# Altium schematic sheet Precharge.SchDoc
size A3
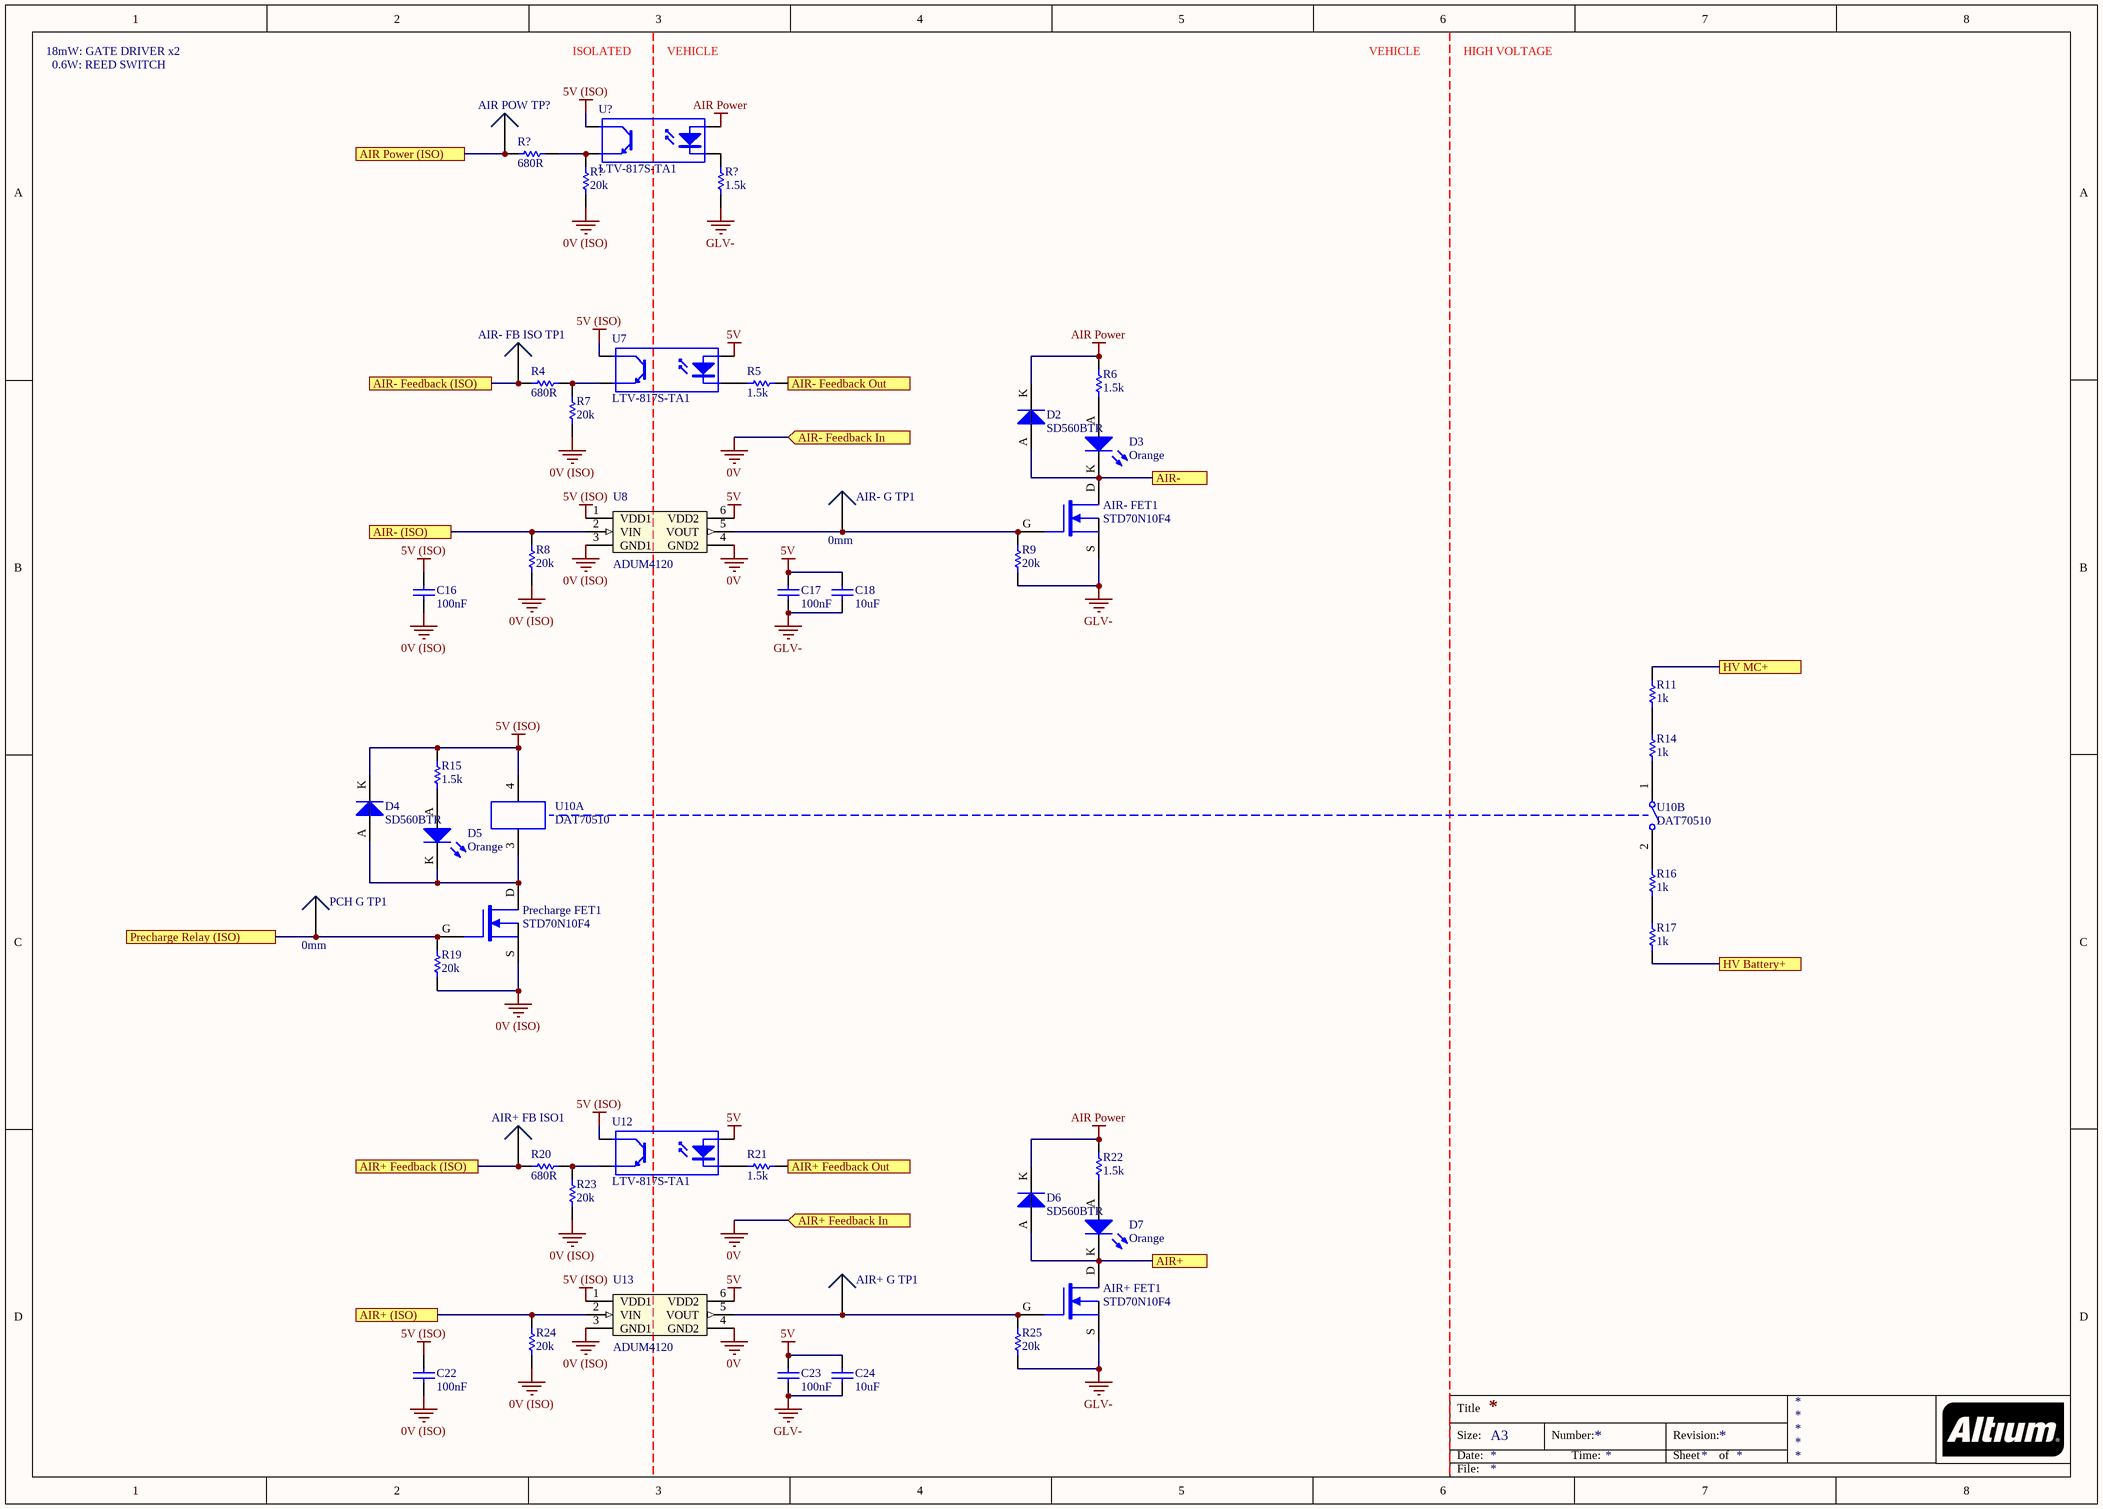
[diagram p0: Precharge.SchDoc]

## Parts
(Parts that share a designator on the sheet are numbered #1, #2 ... from top to bottom, then left to right.)
AIR+_FB_ISO1  0mm  [SMD Test Point]  (value not drawn)
AIR+_FET1  STD70N10F4  [SOT-343_N]
AIR+_G_TP1  0mm  [SMD Test Point]  (value not drawn)
AIR-_FB_ISO_TP1  0mm  [SMD Test Point]  (value not drawn)
AIR-_FET1  STD70N10F4  [SOT-343_N]
AIR-_G_TP1  0mm  [SMD Test Point]
AIR_POW_TP?  0mm  [SMD Test Point]  (value not drawn)
C16  100nF  [0805]
C17  100nF  [0805]
C18  10uF  [0805]
C22  100nF  [0805]
C23  100nF  [0805]
C24  10uF  [0805]
D2  SD560BTR  [SMB Diode]
D3  Orange  [0805 LED]
D4  SD560BTR  [SMB Diode]
D5  Orange  [0805 LED]
D6  SD560BTR  [SMB Diode]
D7  Orange  [0805 LED]
PCH_G_TP1  0mm  [SMD Test Point]
Precharge_FET1  STD70N10F4  [SOT-343_N]
R4  680R  [0805]
R5  1.5k  [0805]
R6  1.5k  [0805]
R7  20k  [0805]
R8  20k  [0805]
R9  20k  [0805]
R11  1k  [B TO-263]
R14  1k  [B TO-263]
R15  1.5k  [0805]
R16  1k  [B TO-263]
R17  1k  [B TO-263]
R19  20k  [0805]
R20  680R  [0805]
R21  1.5k  [0805]
R22  1.5k  [0805]
R23  20k  [0805]
R24  20k  [0805]
R25  20k  [0805]
R?#1  680R  [0805]
R?#2  1.5k  [0805]
R?#3  20k  [0805]
U7  LTV-817S-TA1  [ON 4-SMD]
U8  ADUM4120  [AD 6-SOIC]
U10  DAT70510  [C3 SPST]  (parts A,B of 2)
U12  LTV-817S-TA1  [ON 4-SMD]
U13  ADUM4120  [AD 6-SOIC]
U?  LTV-817S-TA1  [ON 4-SMD]

## Ports
AIR Power (ISO), AIR+, AIR+ (ISO), AIR+ Feedback (ISO), AIR+ Feedback In (in), AIR+ Feedback Out (out), AIR-, AIR- (ISO), AIR- Feedback (ISO), AIR- Feedback In (in), AIR- Feedback Out (out), HV Battery+, HV MC+, Precharge Relay (ISO)

## Nets
0V: U8.4(GND2) U13.4(GND2) ; port AIR- Feedback In, port AIR+ Feedback In
0V (ISO): C16.1 C22.1 Precharge_FET1.S R7.1 R8.1 R19.1 R23.1 R24.1 R?#3.1 U8.3(GND1) U13.3(GND1)
5V: C17.2 C18.2 C23.2 C24.2 U7.1(A) U8.6(VDD2) U12.1(A) U13.6(VDD2)
5V (ISO): C16.2 C22.2 D4.K R15.2 U7.4(C) U8.1(VDD1) U10.4 U12.4(C) U13.1(VDD1) U?.4(C)
AIR Power: D2.K D6.K R6.2 R22.2 U?.1(A)
GLV-: AIR+_FET1.S AIR-_FET1.S C17.1 C18.1 C23.1 C24.1 R9.1 R25.1 R?#2.2
AIR Power (ISO): AIR_POW_TP?.1 R?#1.1 ; port AIR Power (ISO)
AIR+: AIR+_FET1.D D6.A D7.K ; port AIR+
AIR+ (ISO): R24.2 U13.2(VIN) ; port AIR+ (ISO)
AIR+ Feedback (ISO): AIR+_FB_ISO1.1 R20.1 ; port AIR+ Feedback (ISO)
AIR+ Feedback Out: R21.2 ; port AIR+ Feedback Out
AIR-: AIR-_FET1.D D2.A D3.K ; port AIR-
AIR- (ISO): R8.2 U8.2(VIN) ; port AIR- (ISO)
AIR- Feedback (ISO): AIR-_FB_ISO_TP1.1 R4.1 ; port AIR- Feedback (ISO)
AIR- Feedback Out: R5.2 ; port AIR- Feedback Out
HV Battery+: R17.1 ; port HV Battery+
HV MC+: R11.2 ; port HV MC+
Precharge Relay (ISO): PCH_G_TP1.1 Precharge_FET1.G R19.2 ; port Precharge Relay (ISO)
NetAIR+_FET1_G: AIR+_FET1.G AIR+_G_TP1.1 R25.2 U13.5(VOUT)
NetAIR-_FET1_G: AIR-_FET1.G AIR-_G_TP1.1 R9.2 U8.5(VOUT)
NetD3_A: D3.A R6.1
NetD4_A: D4.A D5.K Precharge_FET1.D U10.3
NetD5_A: D5.A R15.1
NetD7_A: D7.A R22.1
NetR4_2: R4.2 R7.2 U7.3(E)
NetR5_1: R5.1 U7.2(K)
NetR11_1: R11.1 R14.2
NetR14_1: R14.1 U10.1
NetR16_1: R16.1 R17.2
NetR20_2: R20.2 R23.2 U12.3(E)
NetR21_1: R21.1 U12.2(K)
NetR?#1_2: R?#1.2 R?#3.2 U?.3(E)
NetR?#2_1: R?#2.1 U?.2(K)

Not connected (* = marked no-connect by the designer): R16 2; U10 2

## Notes on the sheet
- 18mW: GATE DRIVER x2
- 0.6W: REED SWITCH
- ISOLATED
- VEHICLE
- HIGH VOLTAGE
- Title
- Size:
- Date:
- A3
- Number:
- Time:
- Revision:
- Sheet
- of
- File:

## Library data of the parts
AIR+_FB_ISO1 AIR+_G_TP1 AIR-_FB_ISO_TP1 AIR-_G_TP1 AIR_POW_TP? PCH_G_TP1 = SMD Test Point: Positions: 1; Row Spacing: 0; Flange: No; Contact: NA; Part Number: SMD Test Point; Pitch: 0mm; Angle: 0
AIR+_FET1 AIR-_FET1 Precharge_FET1 = STD70N10F4: N-Channel 100V 60A (Tc) 125W (Tc) Surface Mount DPAK; Manufacturer: STMicroelectronics; Published: 24-Mar-1999; LatestRevisionDate: 29-May-2009; LatestRevisionNote: IPC-7351 Footprint Added.; PackageVersion: Sep-2000; PackageReference: SOT-343; Publisher: Altium Limited; PackageDescription: 4-Pin SOT-343 Package 1.3 mm Pitch, 2.1 mm Lead Span; Part Number: STD70N10F4; Digikey Part Number: 497-8806-2-ND; Digikey Link: https://www.digikey.com/product-detail/en/stmicroelectronics/STD70N10F4/497-8806-2-ND/2035599
C16 C17 C22 C23 = GCM21BR71E104KA37L: Manufacturer: muRata; Tolerance: 10%; Material: X7R; Rated Voltage: 25V; Part Number: GCM21BR71E104KA37L; Value: 100nF
C18 C24 = GCM21BR61A106KA37L: Manufacturer: muRata; Tolerance: 10%; Material: X5R; Rated Voltage: 10V; Part Number: GCM21BR61A106KA37L; Value: 10uF
D2 D4 D6 = SD560BTR: 1.2V_F 600V 5A SMB; Manufacturer: SMC Diode Solutions; Part Number: SD560BTR; Digikey Part Number: 1655-1530-2-ND; Digikey Link: https://www.digikey.com/product-detail/en/smc-diode-solutions/SD560BTR/1655-1530-2-ND/6022620
D3 D5 D7 = SML-211DTT86: Orange LED Indication - Discrete 1.75V 0805 (2012 Metric); Manufacturer: ROHM Semiconductor; Part Number: SML-211DTT86; Colour: Orange; Digikey Part Number: 511-1291-1-ND; Digikey Link: https://www.digikey.com/product-detail/en/rohm-semiconductor/SML-211DTT86/511-1291-1-ND/637104
R4 R20 R?#1 = RC0805FR07680RL: Manufacturer: YAGEO; Tolerance: 0.01; Rated Voltage: 0.125W; Part Number: RC0805FR07680RL; Value: 680R; Material: FR-07
R5 R6 R15 R21 R22 R?#2 = RC0805FR071K5L: Manufacturer: YAGEO; Tolerance: 0.01; Rated Voltage: 0.125W; Part Number: RC0805FR071K5L; Value: 1.5k; Material: FR-07
R7-R9 R19 R23-R25 R?#3 = RC0805FR0720KL: Manufacturer: YAGEO; Tolerance: 0.01; Rated Voltage: 0.125W; Part Number: RC0805FR0720KL; Value: 20k; Material: FR-07
R11 R14 R16 R17 = PWR263S-35-1001J: Manufacturer: Bournes Inc; Tolerance: 0.05; Rated Voltage: 35W; Part Number: PWR263S-35-1001J; Value: 1k; Digikey Part Number: PWR263S-35-1001J-ND
U7 U12 U? = LTV-817S-TA1: 35V 50ma Optocoupler (VF=1.2V); Manufacturer: Lite-On Inc; Part Number: LTV-817S-TA1; Digikey Part Number: 160-1893-2-ND; Digikey Link: https://www.digikey.com/product-detail/en/lite-on-inc/LTV-817S-TA1/160-1893-2-ND/388451
U8 U13 = ADUM4120: DGTL ISO 5KV 1CH GATE DRVR 6SOIC; Manufacturer: Analogue Devices; Part Number: ADUM4120; Digikey Part Number: ADUM4120-1ARIZ-ND; Digikey Link: https://www.digikey.com/product-detail/en/analog-devices-inc/ADUM4120-1ARIZ/ADUM4120-1ARIZ-ND/7324273
U10 = DAT70510: RELAY REED SPST-NO 2A 12V; Manufacturer: Cynergy 3; Part Number: DAT70510; Digikey Part Number: 725-1038-ND; Digikey Link: https://www.digikey.com.au/product-detail/en/cynergy-3/DBT70510/725-1038-ND/752033